# Altium schematic sheet LEDs.SchDoc
size Letter; CompanyName: Ploopy Corporation; Organization: Ploopy Corporation; Address1: 137-1140 Burnhamthorpe Road W; Address2: Mississauga; Address3: Ontario; Address4: Canada L5C 0A3; DocumentNumber: 4; Revision: R1.003; SheetNumber: 4; SheetTotal: 9
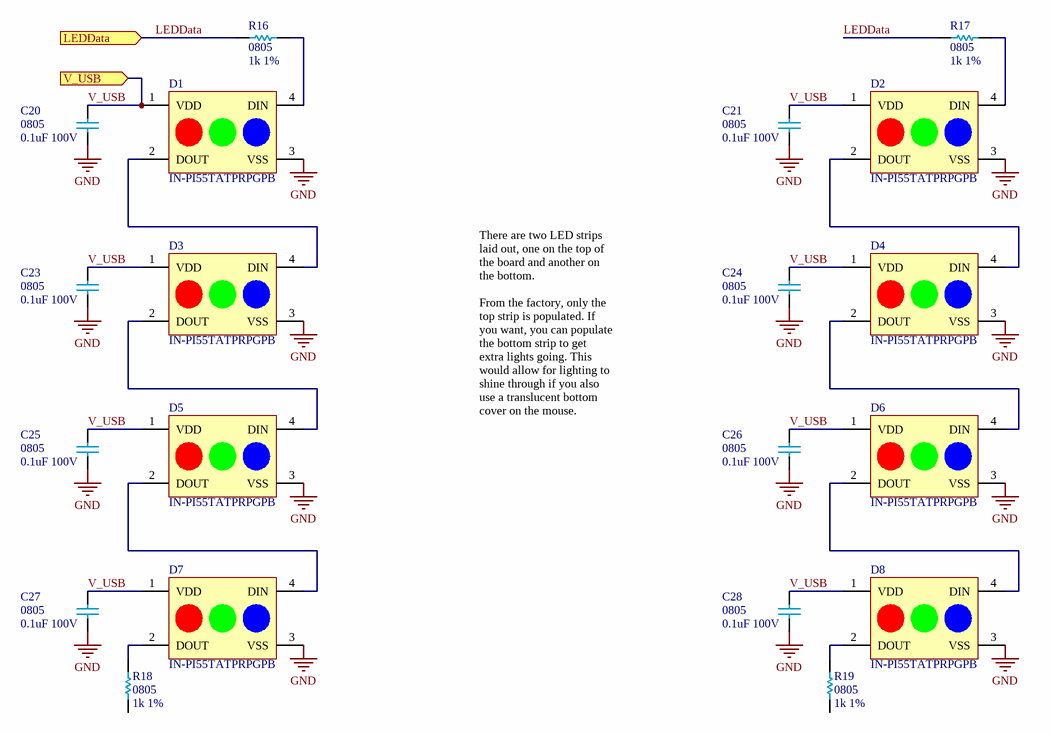
[diagram p0: LEDs.SchDoc]

## Parts
C20  0805  value 0.1uF 100V  [0805]
C21  0805  value 0.1uF 100V  [0805]
C23  0805  value 0.1uF 100V  [0805]
C24  0805  value 0.1uF 100V  [0805]
C25  0805  value 0.1uF 100V  [0805]
C26  0805  value 0.1uF 100V  [0805]
C27  0805  value 0.1uF 100V  [0805]
C28  0805  value 0.1uF 100V  [0805]
D1  IN-PI55TATPRPGPB  [IN-PI55TATPRPGPB]
D2  IN-PI55TATPRPGPB  [IN-PI55TATPRPGPB]
D3  IN-PI55TATPRPGPB  [IN-PI55TATPRPGPB]
D4  IN-PI55TATPRPGPB  [IN-PI55TATPRPGPB]
D5  IN-PI55TATPRPGPB  [IN-PI55TATPRPGPB]
D6  IN-PI55TATPRPGPB  [IN-PI55TATPRPGPB]
D7  IN-PI55TATPRPGPB  [IN-PI55TATPRPGPB]
D8  IN-PI55TATPRPGPB  [IN-PI55TATPRPGPB]
R16  0805  value 1k 1%  [0805]
R17  0805  value 1k 1%  [0805]
R18  0805  value 1k 1%  [0805]
R19  0805  value 1k 1%  [0805]

## Ports
LEDData (in), V_USB (in)

## Nets
GND: C20.1 C21.1 C23.1 C24.1 C25.1 C26.1 C27.1 C28.1 D1.3(VSS) D2.3(VSS) D3.3(VSS) D4.3(VSS) D5.3(VSS) D6.3(VSS) D7.3(VSS) D8.3(VSS)
LEDData: R16.2 R17.2 ; port LEDData
V_USB: C20.2 C21.2 C23.2 C24.2 C25.2 C26.2 C27.2 C28.2 D1.1(VDD) D2.1(VDD) D3.1(VDD) D4.1(VDD) D5.1(VDD) D6.1(VDD) D7.1(VDD) D8.1(VDD) ; port V_USB
NetD1_2: D1.2(DOUT) D3.4(DIN)
NetD1_4: D1.4(DIN) R16.1
NetD2_2: D2.2(DOUT) D4.4(DIN)
NetD2_4: D2.4(DIN) R17.1
NetD3_2: D3.2(DOUT) D5.4(DIN)
NetD4_2: D4.2(DOUT) D6.4(DIN)
NetD5_2: D5.2(DOUT) D7.4(DIN)
NetD6_2: D6.2(DOUT) D8.4(DIN)
NetD7_2: D7.2(DOUT) R18.2
NetD8_2: D8.2(DOUT) R19.2

Not connected (* = marked no-connect by the designer): R18 1; R19 1

## Notes on the sheet
- There are two LED strips laid out, one on the top of the board and another on the bottom.
  From the factory, only the top strip is populated. If you want, you can populate the bottom strip to get extra lights going. This would allow for lighting to shine through if you also use a translucent bottom cover on the mouse.
- Copyright Ploopy Corporation 2024
- Licensed under the CERN-OHL-S v2
- http://ohwr.org/cernohl
- Title:
- PCB:
- Version:
- Ploopy Corporation
- Mississauga ON L5C 0A3
- 137-1140 Burnhamthorpe Road W
- Date:
- Time:
- Sheet
- of
- Canada

## Library data of the parts
C20 C21 C23-C28 = Cap 0.1uF 100V: 0805, X5R or better; Supplier 1: Digi-Key; Supplier Part Number 1: 1276-6840-2-ND
D1-D8 = IN-PI55TATPRPGPB: ADDRESS LED DISCRETE SERIAL RGB; Supplier 1: Digi-Key; Supplier 2: Arrow; Supplier 3: Mouser; Supplier Part Number 1: 1830-1204-1-ND; Supplier Part Number 2: IN-PI55TATPRPGPB; Supplier Part Number 3: 743-IN-PI55TATPRPGPB
R16-R19 = Res 1k 1% 0805: Chip resistor, 1/8W 100PPM; Supplier 1: Digi-Key; Supplier Part Number 1: RMCF0805FT1K00TR-ND